# Altium schematic sheet W-N-DM-V31_Display.SchDoc: PCB_Project_WNDCVX1X_CONTROL_BOARD
size A3; DrawnBy: Raihan Bin Mofidul; Organization: Walton Hi-Tech Industries Ltd.; DocumentNumber: 1; Revision: 1; SheetNumber: 1
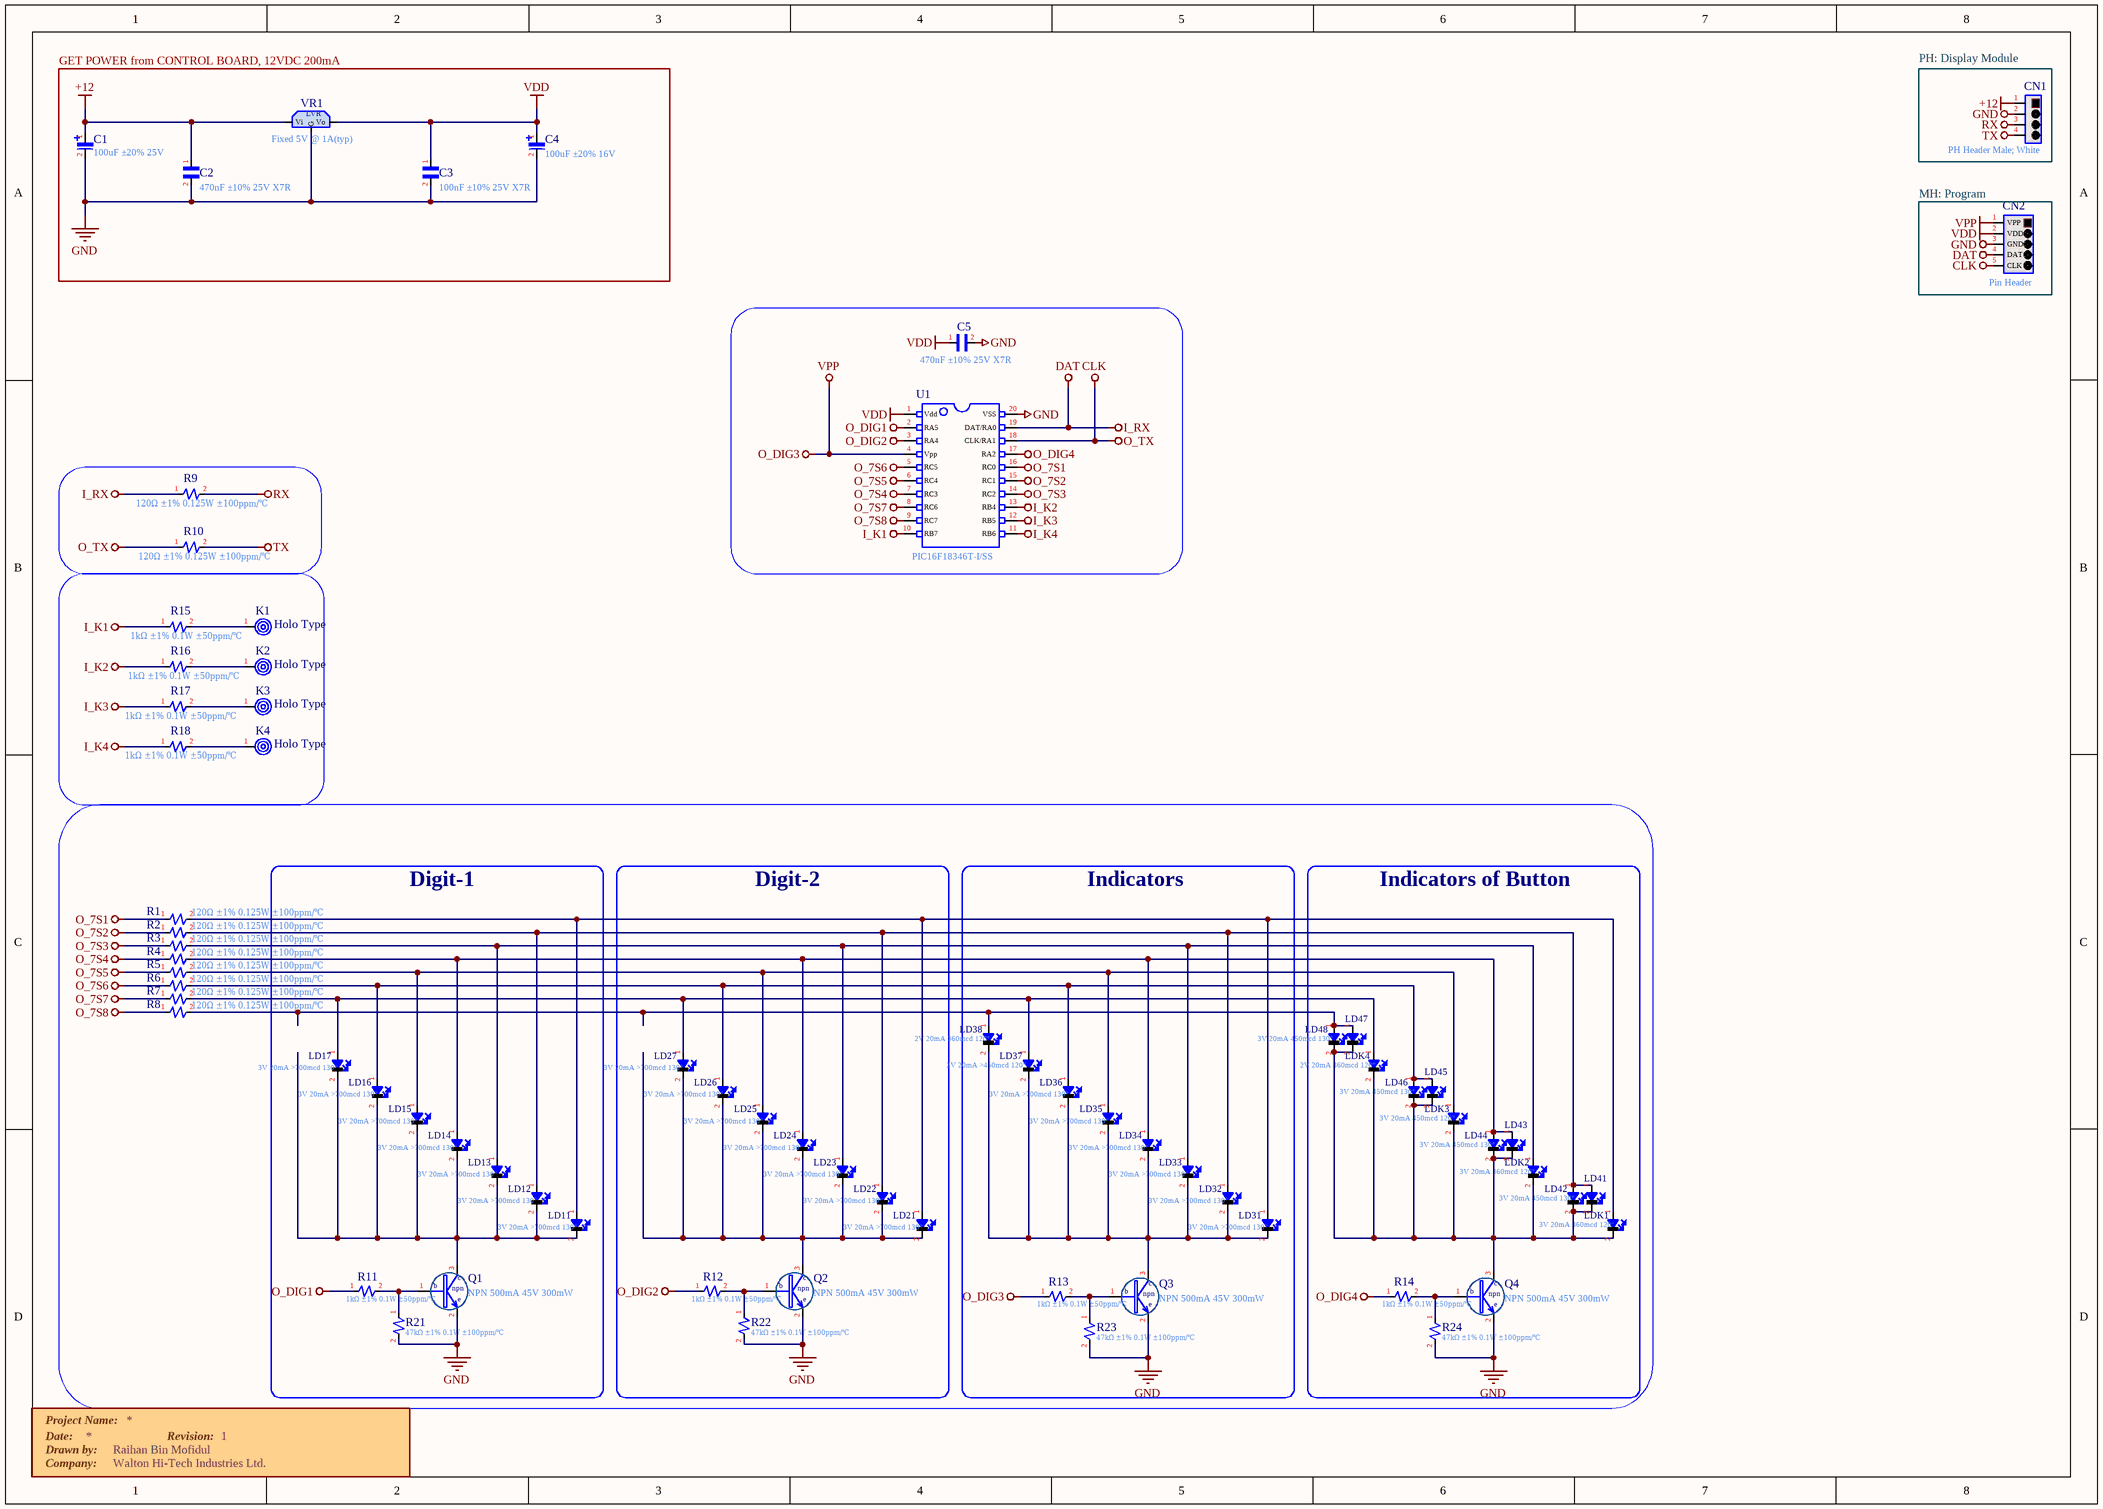
[diagram p0: W-N-DM-V31_Display.SchDoc]

## Parts
C1  100uF ±20% 25V  [C_SMD_Ø6.3*5.4mm]
C2  470nF ±10% 25V X7R  [C_0603]
C3  100nF ±10% 25V X7R  [C_0603]
C4  100uF ±20% 16V  [C_SMD_Ø6.3*5.4mm]
C5  470nF ±10% 25V X7R  [C_0603]
CN1  PH Header Male; White  [CN_4P_A2001WR-S-XP-LCP]
CN2  Pin Header  [CN_PIC_MCU_Debugger_RightAngle]
K1  Holo Type  [K_Cap-Touch_with_LED-Option]
K2  Holo Type  [K_Cap-Touch_with_LED-Option]
K3  Holo Type  [K_Cap-Touch_with_LED-Option]
K4  Holo Type  [K_Cap-Touch_with_LED-Option]
LD11  3V 20mA >700mcd 130°  [LED_SMD0603]
LD12  3V 20mA >700mcd 130°  [LED_SMD0603]
LD13  3V 20mA >700mcd 130°  [LED_SMD0603]
LD14  3V 20mA >700mcd 130°  [LED_SMD0603]
LD15  3V 20mA >700mcd 130°  [LED_SMD0603]
LD16  3V 20mA >700mcd 130°  [LED_SMD0603]
LD17  3V 20mA >700mcd 130°  [LED_SMD0603]
LD21  3V 20mA >700mcd 130°  [LED_SMD0603]
LD22  3V 20mA >700mcd 130°  [LED_SMD0603]
LD23  3V 20mA >700mcd 130°  [LED_SMD0603]
LD24  3V 20mA >700mcd 130°  [LED_SMD0603]
LD25  3V 20mA >700mcd 130°  [LED_SMD0603]
LD26  3V 20mA >700mcd 130°  [LED_SMD0603]
LD27  3V 20mA >700mcd 130°  [LED_SMD0603]
LD31  3V 20mA >700mcd 130°  [LED_SMD0603]
LD32  3V 20mA >700mcd 130°  [LED_SMD0603]
LD33  3V 20mA >700mcd 130°  [LED_SMD0603]
LD34  3V 20mA >700mcd 130°  [LED_SMD0603]
LD35  3V 20mA >700mcd 130°  [LED_SMD0603]
LD36  3V 20mA >700mcd 130°  [LED_SMD0603]
LD37  2V 20mA >450mcd 120°  [LED_SMD0603]
LD38  2V 20mA 360mcd 120°  [LED_SMD0603]
LD41  3V 20mA 450mcd 130°  [LED_SMD0603]  (value not drawn)
LD42  3V 20mA 450mcd 130°  [LED_SMD0603]
LD43  3V 20mA 450mcd 130°  [LED_SMD0603]  (value not drawn)
LD44  3V 20mA 450mcd 130°  [LED_SMD0603]
LD45  3V 20mA 450mcd 130°  [LED_SMD0603]  (value not drawn)
LD46  3V 20mA 450mcd 130°  [LED_SMD0603]
LD47  3V 20mA 450mcd 130°  [LED_SMD0603]  (value not drawn)
LD48  3V 20mA 450mcd 130°  [LED_SMD0603]
LDK1  3V 20mA 360mcd 120°  [LED_SMD0603]
LDK2  3V 20mA 360mcd 120°  [LED_SMD0603]
LDK3  3V 20mA 450mcd 120°  [LED_SMD0603]
LDK4  2V 20mA 360mcd 120°  [LED_SMD0603]
Q1  NPN 500mA 45V 300mW  [Q_SOT-23_NPN]
Q2  NPN 500mA 45V 300mW  [Q_SOT-23_NPN]
Q3  NPN 500mA 45V 300mW  [Q_SOT-23_NPN]
Q4  NPN 500mA 45V 300mW  [Q_SOT-23_NPN]
R1  120Ω ±1% 0.125W ±100ppm/℃  [R_0603]
R2  120Ω ±1% 0.125W ±100ppm/℃  [R_0603]
R3  120Ω ±1% 0.125W ±100ppm/℃  [R_0603]
R4  120Ω ±1% 0.125W ±100ppm/℃  [R_0603]
R5  120Ω ±1% 0.125W ±100ppm/℃  [R_0603]
R6  120Ω ±1% 0.125W ±100ppm/℃  [R_0603]
R7  120Ω ±1% 0.125W ±100ppm/℃  [R_0603]
R8  120Ω ±1% 0.125W ±100ppm/℃  [R_0603]
R9  120Ω ±1% 0.125W ±100ppm/℃  [R_0603]
R10  120Ω ±1% 0.125W ±100ppm/℃  [R_0603]
R11  1kΩ ±1% 0.1W ±50ppm/℃  [R_0603]
R12  1kΩ ±1% 0.1W ±50ppm/℃  [R_0603]
R13  1kΩ ±1% 0.1W ±50ppm/℃  [R_0603]
R14  1kΩ ±1% 0.1W ±50ppm/℃  [R_0603]
R15  1kΩ ±1% 0.1W ±50ppm/℃  [R_0603]
R16  1kΩ ±1% 0.1W ±50ppm/℃  [R_0603]
R17  1kΩ ±1% 0.1W ±50ppm/℃  [R_0603]
R18  1kΩ ±1% 0.1W ±50ppm/℃  [R_0603]
R21  47kΩ ±1% 0.1W ±100ppm/℃  [R_0603]
R22  47kΩ ±1% 0.1W ±100ppm/℃  [R_0603]
R23  47kΩ ±1% 0.1W ±100ppm/℃  [R_0603]
R24  47kΩ ±1% 0.1W ±100ppm/℃  [R_0603]
U1  PIC16F18346T-I/SS  [U_PIC_20pin_SSOP]
VR1  Fixed 5V @ 1A(typ)  [VR_TO-252-2(DPAK)]

## Blocks framed on the sheet
GET POWER from CONTROL BOARD, 12VDC 200mA: C1-C4 VR1
PH: Display Module: CN1
MH: Program: CN2
Digit-1: LD11-LD17 Q1 R11 R21
Digit-2: LD21-LD27 Q2 R12 R22
Indicators: LD31-LD38 Q3 R13 R23
Indicators of Button: LD41-LD48 LDK1-LDK4 Q4 R14 R24

## Nets
+12: C1.1 C2.1 CN1.1 VR1.V-IN(Vi)
CLK: CN2.5(CLK) R10.1 U1.18(CLK/RA1)  [also labelled O_TX]
DAT: CN2.4(DAT) R9.1 U1.19(DAT/RA0)  [also labelled I_RX]
GND: C1.2 C2.2 C3.2 C4.2 C5.2 CN1.2 CN2.3(GND) Q1.2(Emitter) Q2.2(Emitter) Q3.2(Emitter) Q4.2(Emitter) R21.2 R22.2 R23.2 R24.2 U1.20(VSS) VR1.GND(G)
I_K1: R15.1 U1.10(RB7)
I_K2: R16.1 U1.13(RB4)
I_K3: R17.1 U1.12(RB5)
I_K4: R18.1 U1.11(RB6)
O_7S1: R1.1 U1.16(RC0)
O_7S2: R2.1 U1.15(RC1)
O_7S3: R3.1 U1.14(RC2)
O_7S4: R4.1 U1.7(RC3)
O_7S5: R5.1 U1.6(RC4)
O_7S6: R6.1 U1.5(RC5)
O_7S7: R7.1 U1.8(RC6)
O_7S8: R8.1 U1.9(RC7)
O_DIG1: R11.1 U1.2(RA5)
O_DIG2: R12.1 U1.3(RA4)
O_DIG3: CN2.1(VPP) R13.1 U1.4(Vpp)  [also labelled VPP]
O_DIG4: R14.1 U1.17(RA2)
RX: CN1.3 R9.2
TX: CN1.4 R10.2
VDD: C3.1 C4.1 C5.1 CN2.2(VDD) U1.1(Vdd) VR1.V-OUT(Vo)
NetK1_1: K1.1 R15.2
NetK2_1: K2.1 R16.2
NetK3_1: K3.1 R17.2
NetK4_1: K4.1 R18.2
NetLD11_1: LD11.1(vdd) LD21.1(vdd) LD31.1(vdd) LDK1.1(vdd) R1.2
NetLD11_2: LD11.2(vss) LD12.2(vss) LD13.2(vss) LD14.2(vss) LD15.2(vss) LD16.2(vss) LD17.2(vss) Q1.3(Collector)
NetLD12_1: LD12.1(vdd) LD22.1(vdd) LD32.1(vdd) LD41.1(vdd) LD42.1(vdd) R2.2
NetLD13_1: LD13.1(vdd) LD23.1(vdd) LD33.1(vdd) LDK2.1(vdd) R3.2
NetLD14_1: LD14.1(vdd) LD24.1(vdd) LD34.1(vdd) LD43.1(vdd) LD44.1(vdd) R4.2
NetLD15_1: LD15.1(vdd) LD25.1(vdd) LD35.1(vdd) LDK3.1(vdd) R5.2
NetLD16_1: LD16.1(vdd) LD26.1(vdd) LD36.1(vdd) LD45.1(vdd) LD46.1(vdd) R6.2
NetLD17_1: LD17.1(vdd) LD27.1(vdd) LD37.1(vdd) LDK4.1(vdd) R7.2
NetLD21_2: LD21.2(vss) LD22.2(vss) LD23.2(vss) LD24.2(vss) LD25.2(vss) LD26.2(vss) LD27.2(vss) Q2.3(Collector)
NetLD31_2: LD31.2(vss) LD32.2(vss) LD33.2(vss) LD34.2(vss) LD35.2(vss) LD36.2(vss) LD37.2(vss) LD38.2(vss) Q3.3(Collector)
NetLD38_1: LD38.1(vdd) LD47.1(vdd) LD48.1(vdd) R8.2
NetLD41_2: LD41.2(vss) LD42.2(vss) LD43.2(vss) LD44.2(vss) LD45.2(vss) LD46.2(vss) LD47.2(vss) LD48.2(vss) LDK1.2(vss) LDK2.2(vss) LDK3.2(vss) LDK4.2(vss) Q4.3(Collector)
NetQ1_1: Q1.1(Base) R11.2 R21.1
NetQ2_1: Q2.1(Base) R12.2 R22.1
NetQ3_1: Q3.1(Base) R13.2 R23.1
NetQ4_1: Q4.1(Base) R14.2 R24.1

## Notes on the sheet
- Project Name:
- Date:
- Drawn by:
- Revision:
- Company:
- Title
- Size:
- A4
- Number:
- Time:
- Sheet
- of
- File:
- (in symbol Transistor>> BJT npn) c; b; npn; e
- (in symbol Voltage Regulator) LVR

## Library data of the parts
C1 C4 = Capacitor>> Polar: SMD,6.3x5.4mm Aluminum Electrolytic Capacitors - SMD RoHS
C2 C3 C5 = Capacitor>> Non-Polar: 0603 Multilayer Ceramic Capacitors MLCC - SMD/SMT RoHS
CN1 = Connector>> 4Pins: A2001WR-S-4P; Pin 0.079"(2.00mm) 4 SMD,P=2mm Wire To Board / Wire To Wire Connector RoHS
CN2 = Connector>> PIC Program: A2541WR-5P/MTB125-1105R1/PZ254R-11-05P ;5pins, right-angle 90degrees 2.54mm Through Hole,P=2.54mm Pin Header & Female Header RoHS
K1-K4 = Key>> Cap Touch
LD11-LD17 LD21-LD27 LD31-LD36 = LED>> General Purpose: MHT192WDT-ICE; ICE-BLUE Color - 0603 Light Emitting Diodes (LED) RoHS
LD37 = LED>> General Purpose: MHT192URCT; Brilliant Red Color - 0603 Light Emitting Diodes (LED) RoHS
LD38 LDK4 = LED>> General Purpose: MHT192USCT; Brilliant Orange Color - 0603 Light Emitting Diodes (LED) RoHS
LD41-LD48 = LED>> General Purpose: MHT192WDT-C2; WHITE Color - 0603 Light Emitting Diodes (LED) RoHS
LDK1 LDK2 = LED>> General Purpose: MHT192UBCT; Brilliant Blue Color - 0603 Light Emitting Diodes (LED) RoHS
LDK3 = LED>> General Purpose: MHT192UGCT; Brilliant Green Color - 0603 Light Emitting Diodes (LED) RoHS
Q1-Q4 = Transistor>> BJT npn: BC817-40; SOT-23(SOT-23-3) Transistors (NPN/PNP) RoHS
R1-R10 = Resistor>> General Purpose: RK73H1JTTD1200F; 0603 Chip Resistor - Surface Mount RoHS
R11-R18 = Resistor>> General Purpose: RK73G1JTTD1001F; 0603 Chip Resistor - Surface Mount RoHS
R21-R24 = Resistor>> General Purpose: RK73H1JTTD4702F; 0603 Chip Resistor - Surface Mount RoHS
U1 = IC>> PIC 20Pins: Lead Count: 20 / Package Type: SSOP / Temp Range: -40C to +85C / Packing Media: Tape and reel (1600)
VR1 = Voltage Regulator: CJ78D05/MC7805BDTRKG; TO-252-2(DPAK) Dropout Regulators(LDO) RoHS